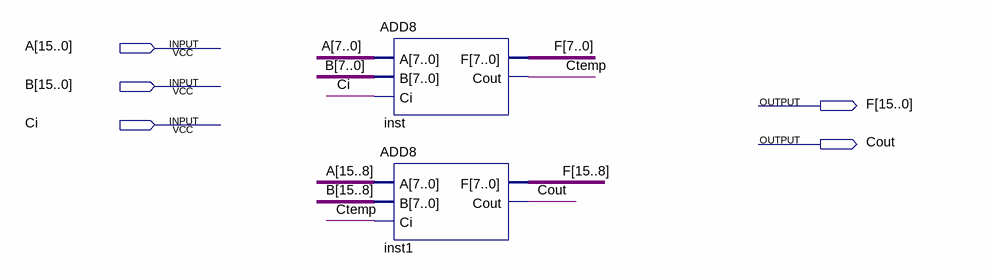
[diagram p0: schematic sheet]
// Quartus schematic ADD16.bdf as structural Verilog: 2 symbols, 5 pins
module ADD16 (
  input  [15:0] A,
  input  [15:0] B,
  input  Ci,
  output [15:0] F,
  output Cout
);

  wire Ctemp;

  ADD8 inst (.A(A[7:0]), .B(B[7:0]), .Ci(Ci), .F(F[7:0]), .Cout(Ctemp));
  ADD8 inst1 (.A(A[15:8]), .B(B[15:8]), .Ci(Ctemp), .F(F[15:8]), .Cout(Cout));
endmodule
